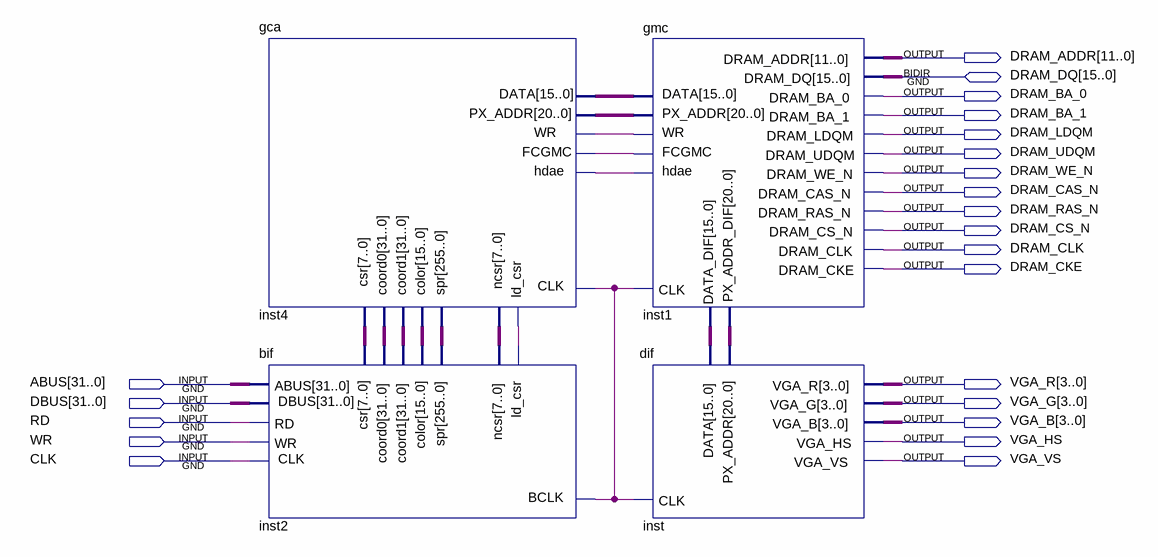
[diagram p0: schematic sheet]
// Quartus schematic gpu.bdf as structural Verilog: 4 symbols, 22 pins
module gpu (
  input  [31:0] ABUS,
  input  [31:0] DBUS,
  input  RD,
  input  WR,
  input  CLK,
  inout  [15:0] DRAM_DQ,
  output [11:0] DRAM_ADDR,
  output DRAM_BA_0,
  output DRAM_BA_1,
  output DRAM_LDQM,
  output DRAM_UDQM,
  output DRAM_WE_N,
  output DRAM_CAS_N,
  output DRAM_RAS_N,
  output DRAM_CS_N,
  output DRAM_CLK,
  output DRAM_CKE,
  output [3:0] VGA_R,
  output [3:0] VGA_G,
  output [3:0] VGA_B,
  output VGA_HS,
  output VGA_VS
);

  wire inst1_fcgmc, inst2_bclk, inst4_hdae, inst4_ld_csr, inst4_wr;
  wire [7:0] inst2_csr, inst4_ncsr;
  wire [15:0] inst1_data_dif, inst2_color, inst4_data;
  wire [20:0] inst4_px_addr, inst_px_addr;
  wire [31:0] inst2_coord0, inst2_coord1;
  wire [255:0] inst2_spr;

  gca inst4 (
    .coord0(inst2_coord0), .coord1(inst2_coord1), .CLK(inst2_bclk), .FCGMC(inst1_fcgmc), .csr(inst2_csr),
    .color(inst2_color), .spr(inst2_spr), .ld_csr(inst4_ld_csr), .PX_ADDR(inst4_px_addr), .DATA(inst4_data),
    .WR(inst4_wr), .ncsr(inst4_ncsr), .hdae(inst4_hdae));
  bif inst2 (
    .ld_csr(inst4_ld_csr), .RD(RD), .ABUS(ABUS), .WR(WR), .CLK(CLK), .ncsr(inst4_ncsr),
    .coord0(inst2_coord0), .coord1(inst2_coord1), .BCLK(inst2_bclk), .csr(inst2_csr), .color(inst2_color),
    .spr(inst2_spr), .DBUS(DBUS));
  gmc inst1 (
    .CLK(inst2_bclk), .PX_ADDR_DIF(inst_px_addr), .DATA(inst4_data), .PX_ADDR(inst4_px_addr), .WR(inst4_wr),
    .hdae(inst4_hdae), .DRAM_BA_0(DRAM_BA_0), .DRAM_BA_1(DRAM_BA_1), .DRAM_LDQM(DRAM_LDQM),
    .DRAM_UDQM(DRAM_UDQM), .DRAM_WE_N(DRAM_WE_N), .DRAM_CAS_N(DRAM_CAS_N), .DRAM_RAS_N(DRAM_RAS_N),
    .DRAM_CS_N(DRAM_CS_N), .DRAM_CLK(DRAM_CLK), .DRAM_CKE(DRAM_CKE), .DRAM_ADDR(DRAM_ADDR),
    .DATA_DIF(inst1_data_dif), .FCGMC(inst1_fcgmc), .DRAM_DQ(DRAM_DQ));
  dif inst (
    .DATA(inst1_data_dif), .CLK(inst2_bclk), .VGA_R(VGA_R), .VGA_G(VGA_G), .VGA_B(VGA_B), .VGA_HS(VGA_HS),
    .VGA_VS(VGA_VS), .PX_ADDR(inst_px_addr));
endmodule
